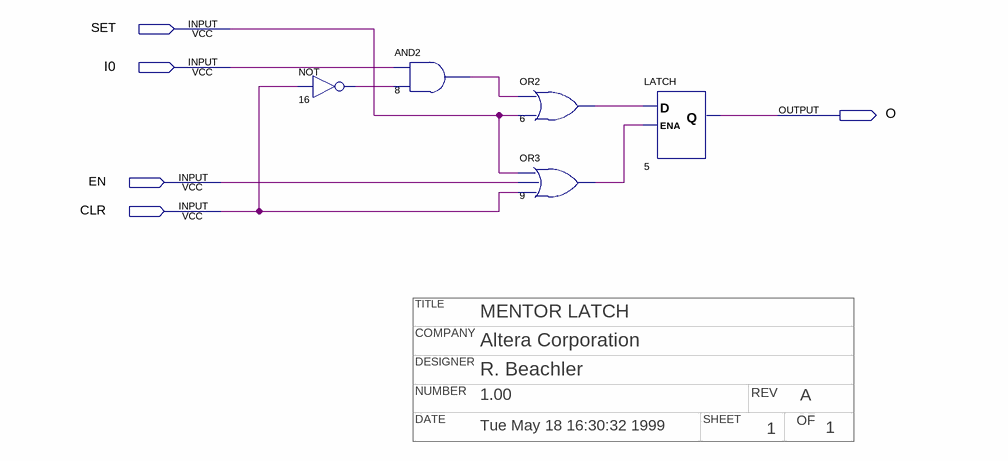
[diagram p0: schematic sheet]
// Quartus schematic mlatch.bdf as structural Verilog: 5 symbols, 5 pins
// Title block: TITLE: MENTOR LATCH; COMPANY: Altera Corporation; DESIGNER: R. Beachler; NUMBER: 1.00; REV: A; DATE: Tue May 18 16:30:32 1999; SHEET: 1; OF: 1
module mlatch (
  input  SET,
  input  I0,
  input  EN,
  input  CLR,
  output O
);

  wire n6_out, n8_out, n9_out, n16_out;

  not u_16 (n16_out, CLR);
  and u_8 (n8_out, I0, n16_out);
  or u_6 (n6_out, n8_out, SET);
  or u_9 (n9_out, SET, EN, CLR);
  LATCH u_5 (.D(n6_out), .ENA(n9_out), .Q(O));
endmodule
